# Altium schematic sheet daughterboard.SchDoc
size A4; SheetNumber: 1; SheetTotal: 1
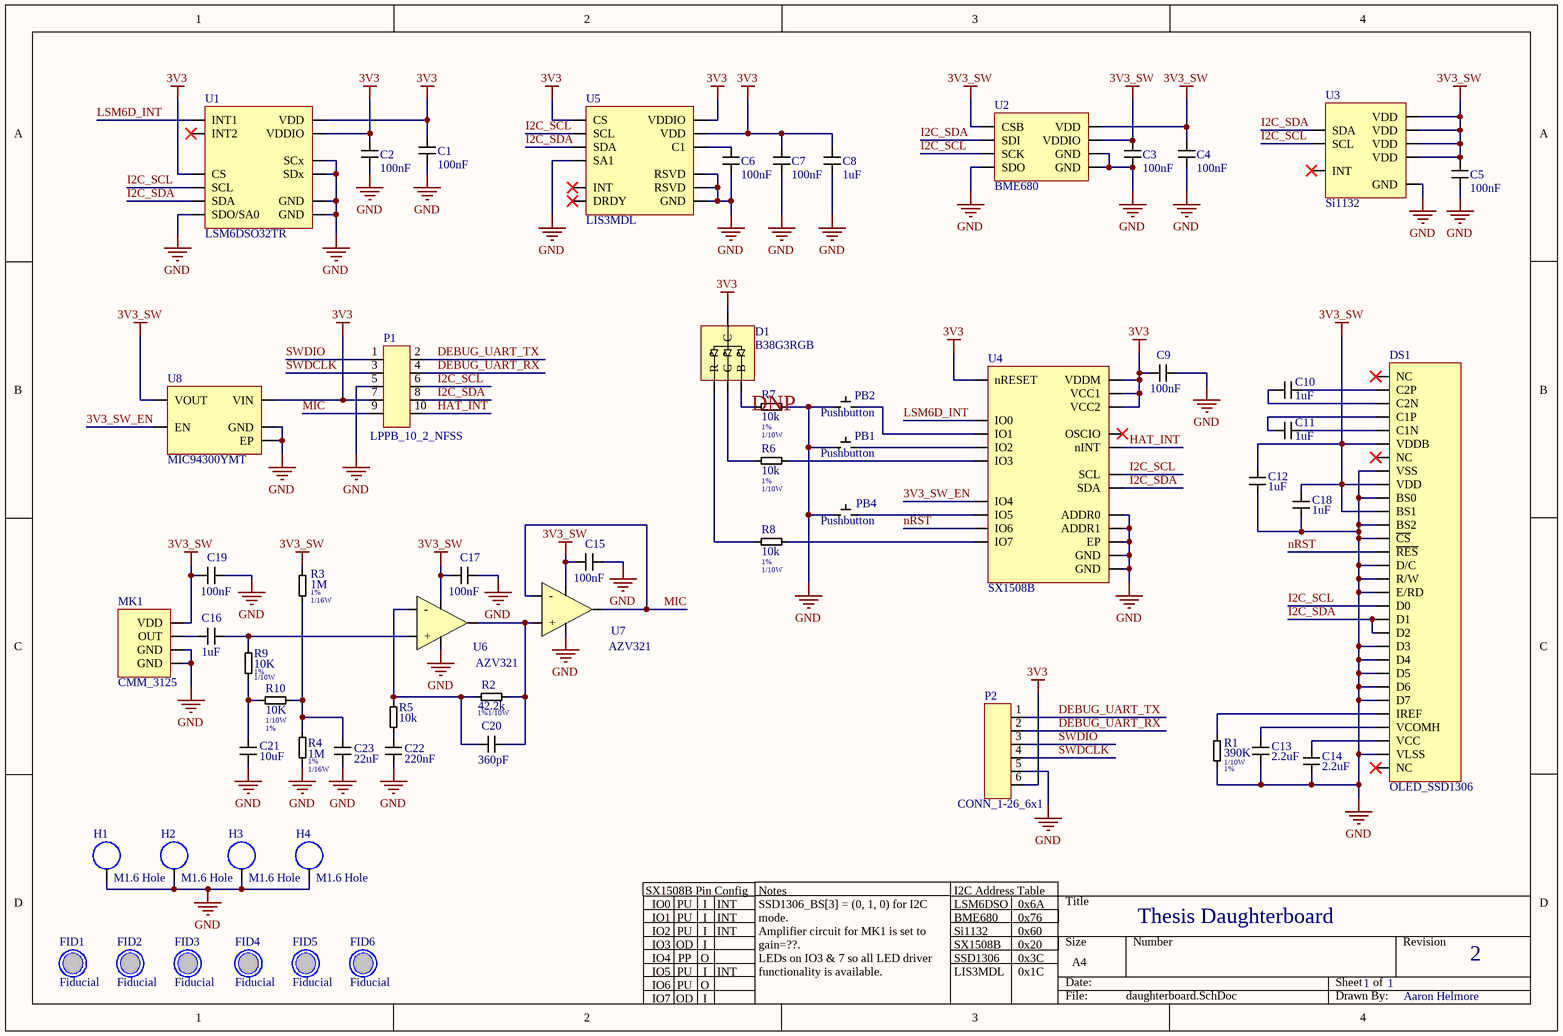
[diagram p0: daughterboard.SchDoc]

## Parts
C1  100nF  [CAP_0402]
C2  100nF  [CAP_0402]
C3  100nF  [CAP_0402]
C4  100nF  [CAP_0402]
C5  100nF  [CAP_0402]
C6  100nF  [CAP_0402]
C7  100nF  [CAP_0402]
C8  1uF  [CAP_0402]
C9  100nF  [CAP_0402]
C10  1uF  [CAP_0402]
C11  1uF  [CAP_0402]
C12  1uF  [CAP_0402]
C13  2.2uF  [CAP_0603]
C14  2.2uF  [CAP_0603]
C15  100nF  [CAP_0402]
C16  1uF  [CAP_0402]
C17  100nF  [CAP_0402]
C18  1uF  [CAP_0402]
C19  100nF  [CAP_0402]
C20  360pF  [CAP_0603]
C21  10uF  [CAP_0603]
C22  220nF  [CAP_0603]
C23  22uF  [CAP_0603]
D1  B38G3RGB  [B38G3RGB]
DS1  OLED_SSD1306  [OLED_0.96Inch_SSD1306]
FID1  Fiducial  [FIDUCIAL_0.5MM_SOLDER_1MM_MASK]
FID2  Fiducial  [FIDUCIAL_0.5MM_SOLDER_1MM_MASK]
FID3  Fiducial  [FIDUCIAL_0.5MM_SOLDER_1MM_MASK]
FID4  Fiducial  [FIDUCIAL_0.5MM_SOLDER_1MM_MASK]
FID5  Fiducial  [FIDUCIAL_0.5MM_SOLDER_1MM_MASK]
FID6  Fiducial  [FIDUCIAL_0.5MM_SOLDER_1MM_MASK]
H1  M1.6 Hole  [M1.6]
H2  M1.6 Hole  [M1.6]
H3  M1.6 Hole  [M1.6]
H4  M1.6 Hole  [M1.6]
MK1  CMM_3125  [CMM_3125]
P1  LPPB_10_2_NFSS  [LPPB_10_2_NFSS]
P2  CONN_1-26_6x1  [851-PP-NNN-40-001101]
PB1  Pushbutton  [EVQP7A]
PB2  Pushbutton  [EVQP7A]
PB4  Pushbutton  [EVQP7A]
R1  390K  Wattage: 1/10W  Tolerance: 1%  [RES_0402]
R2  42.2k  Wattage: 1/10W  Tolerance: 1%  [RES_0402]
R3  1M  Wattage: 1/16W  Tolerance: 1%  [RES_0402]
R4  1M  Wattage: 1/16W  Tolerance: 1%  [RES_0402]
R5  10k  [RES_0402]
R6  10k  Tolerance: 1%  Wattage: 1/10W  [RES_0402]
R7  10k  Tolerance: 1%  Wattage: 1/10W  [RES_0402]
R8  10k  Tolerance: 1%  Wattage: 1/10W  [RES_0402]
R9  10K  Wattage: 1/10W  Tolerance: 1%  [RES_0402]
R10  10K  Wattage: 1/10W  Tolerance: 1%  [RES_0402]
U1  LSM6DSO32TR  [LSM6DSO]
U2  BME680  [BME680]
U3  Si1132  [Si1132]
U4  SX1508B  [QFN40P300X300X60_HS-21N]
U5  LIS3MDL  [LIS3MDL]
U6  AZV321  [SC-70-5]
U7  AZV321  [SC-70-5]
U8  MIC94300YMT  [MIC94300YMT]

## Nets
3V3: C1.2(J11) C2.2(J11) C7.2(J11) C8.2(J11) C9.2(J11) D1.3(C) P1.7 P2.6 U1.5(VDDIO) U1.8(VDD) U1.12(CS) U4.1(nRESET) U4.7(VCC1) U4.14(VDDM) U4.17(VCC2) U5.5(VDD) U5.6(VDDIO) U5.10(CS) U8.4(VIN)
3V3_SW: C3.2(J11) C4.2(J11) C5.2(J11) C12.2(J11) C15.2(J11) C17.2(J11) C18.2(J11) C19.2(J11) DS1.6(VDDB) DS1.9(VDD) DS1.11(BS1) MK1.1(VDD) R3.1 U2.2(CSB) U2.6(VDDIO) U2.8(VDD) U3.3(VDD) U3.6(VDD) U3.7(VDD) U3.9(VDD) U6.5 U7.5 U8.3(VOUT)
GND: C1.1(J12) C2.1(J12) C3.1(J12) C4.1(J12) C5.1(J12) C6.1(J12) C7.1(J12) C8.1(J12) C9.1(J12) C12.1(J12) C13.1(J12) C14.1(J12) C15.1(J12) C17.1(J12) C18.1(J12) C19.1(J12) C21.1(J12) C22.1(J12) C23.1(J12) DS1.8(VSS) DS1.10(BS0) DS1.12(BS2) DS1.13(~{CS}) DS1.15(D/C) DS1.16(R/W) DS1.17(E/RD) DS1.21(D3) DS1.22(D4) DS1.23(D5) DS1.24(D6) DS1.25(D7) DS1.29(VLSS) H1.1 H2.1 H3.1 H4.1 MK1.2(GND) MK1.3(GND) P1.5 P2.5 PB1.2 PB2.2 PB4.2 R1.2 R4.2 R7.2 U1.1(SDO/SA0) U1.2(SDx) U1.3(SCx) U1.6(GND) U1.7(GND) U2.1(GND) U2.5(SDO) U2.7(GND) U3.8(GND) U4.4(ADDR0) U4.8(GND) U4.12(ADDR1) U4.18(GND) U4.21(EP) U5.2(RSVD) U5.3(GND) U5.9(SA1) U5.12(RSVD) U6.2 U7.2 U8.2(GND) U8.EP1(EP)
3V3_SW_EN: U4.15(IO4) U8.1(EN)
DEBUG_UART_RX: P1.4 P2.2
DEBUG_UART_TX: P1.2 P2.1
HAT_INT: P1.10 U4.11(nINT)
I2C_SCL: DS1.18(D0) P1.6 U1.13(SCL) U2.4(SCK) U3.2(SCL) U4.3(SCL) U5.1(SCL)
I2C_SDA: DS1.19(D1) DS1.20(D2) P1.8 U1.14(SDA) U2.3(SDI) U3.1(SDA) U4.2(SDA) U5.11(SDA)
LSM6D_INT: U1.4(INT1) U4.5(IO0)
MIC: P1.9 U7.3(-) U7.4
nRST: DS1.14(~{RES}) U4.19(IO6)
SWDCLK: P1.3 P2.4
SWDIO: P1.1 P2.3
NetC6_2: C6.2(J11) U5.4(C1)
NetC10_1: C10.1(J12) DS1.2(C2P)
NetC10_2: C10.2(J11) DS1.3(C2N)
NetC11_1: C11.1(J12) DS1.5(C1N)
NetC11_2: C11.2(J11) DS1.4(C1P)
NetC13_2: C13.2(J11) DS1.27(VCOMH)
NetC14_2: C14.2(J11) DS1.28(VCC)
NetC16_1: C16.1(J12) R9.1 U6.1(+)
NetC16_2: C16.2(J11) MK1.4(OUT)
NetC20_1: C20.1(J12) R2.2 U6.4 U7.1(+)
NetC20_2: C20.2(J11) R2.1 R5.1 U6.3(-)
NetC21_2: C21.2(J11) R9.2 R10.1
NetC22_2: C22.2(J11) R5.2
NetC23_2: C23.2(J11) R3.2 R4.1 R10.2
NetD1_1: D1.1(G) R6.1
NetD1_2: D1.2(B) R7.1
NetD1_4: D1.4(R) R8.1
NetDS1_26: DS1.26(IREF) R1.1
NetPB1_1: PB1.1 U4.9(IO2)
NetPB2_1: PB2.1 U4.6(IO1)
NetPB4_1: PB4.1 U4.16(IO5)
NetR6_2: R6.2 U4.10(IO3)
NetR8_2: R8.2 U4.20(IO7)

Not connected (* = marked no-connect by the designer): DS1 1(NC)* 7(NC)* 30(NC)*; U1 9(INT2)*; U3 4(INT)*; U4 13(OSCIO)*; U5 7(INT)* 8(DRDY)*

## Notes on the sheet
- (near R7) DNP
- SX1508B Pin Config
- I2C Address Table
- Notes
  SSD1306_BS[3] = (0, 1, 0) for I2C mode.
  Amplifier circuit for MK1 is set to gain=??.
  LEDs on IO3 & 7 so all LED driver functionality is available.
- LSM6DSO
  BME680
  Si1132
  SX1508B
  SSD1306
  LIS3MDL
- 0x6A
  0x76
  0x60
  0x20
  0x3C
  0x1C
- Thesis Daughterboard
- 1
- 2
- IO0
  IO1
  IO2
  IO3
  IO4
  IO5
  IO6
  IO7
- PU
  PU
  PU
  OD
  PP
  PU
  PU
  OD
- I
  I
  I
  I
  O
  I
  O
  I
- INT
  INT
  INT
  INT
- Aaron Helmore

## Library data of the parts
C1-C20 C22 C23 = Capacitor: Dielectric: X5R; Voltage: 25V
  C1-C19: Tolerance: *
C21 = Capacitor: Dielectric: X5R; Voltage: 10V
D1 = B38G3RGB: RGB LED
DS1 = OLED_SSD1306: SSD1306 based OLED display
H1-H4 = M1.6 Mounting Hole
R1-R4 R6-R10 = R_Small
R5 = R_Small: Wattage: 1/10W; Tolerance: 1%
U1 = LSM6DSO32TR: STM IMU
U2 = BME680: Bosch gas, pressure and humidity sensor
U3 = Si1132: UV index and ambient light sensor
U4 = SX1508B: 8 channel GPIO expander with level shifting, LED driver and keypad engine
U5 = LIS3MDL: ST magnetometer
U8 = MIC94300YMT: 200mA load switch